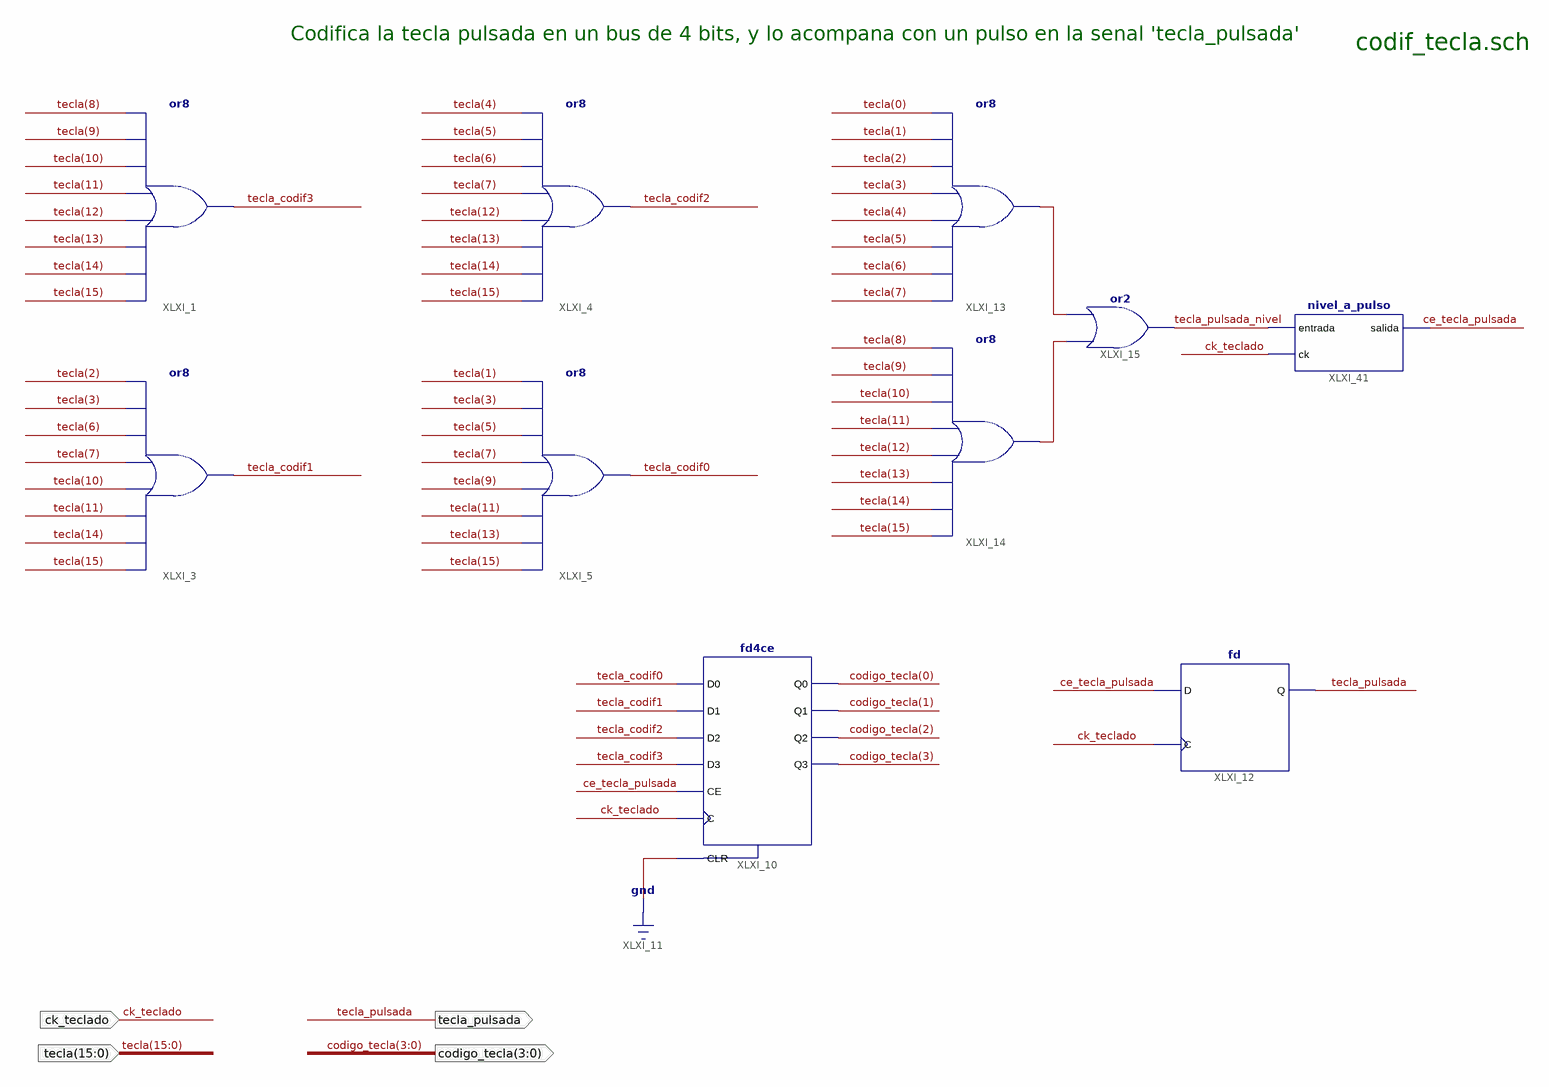
[diagram p0: schematic sheet 1]
// Xilinx ISE schematic codif_tecla.sch (spartan6) as structural Verilog: 10 symbols, 5 ports
module codif_tecla (
  input  [15:0] tecla,
  input  ck_teclado,
  output [3:0] codigo_tecla,
  output tecla_pulsada
);

  wire ce_tecla_pulsada, tecla_codif0, tecla_codif1, tecla_codif2, tecla_codif3, tecla_pulsada_nivel,
       XLXN_209, XLXN_210;

  fd XLXI_12 (.C(ck_teclado), .D(ce_tecla_pulsada), .Q(tecla_pulsada));
  fd4ce XLXI_10 (
    .C(ck_teclado), .CE(ce_tecla_pulsada), .CLR(1'b0), .D0(tecla_codif0), .D1(tecla_codif1),
    .D2(tecla_codif2), .D3(tecla_codif3), .Q0(codigo_tecla[0]), .Q1(codigo_tecla[1]), .Q2(codigo_tecla[2]),
    .Q3(codigo_tecla[3]));
  or XLXI_1 (tecla_codif3, tecla[15], tecla[14], tecla[13], tecla[12], tecla[11], tecla[10], tecla[9], tecla[8]);
  or XLXI_3 (tecla_codif1, tecla[15], tecla[14], tecla[11], tecla[10], tecla[7], tecla[6], tecla[3], tecla[2]);
  or XLXI_4 (tecla_codif2, tecla[15], tecla[14], tecla[13], tecla[12], tecla[7], tecla[6], tecla[5], tecla[4]);
  or XLXI_5 (tecla_codif0, tecla[15], tecla[13], tecla[11], tecla[9], tecla[7], tecla[5], tecla[3], tecla[1]);
  or XLXI_13 (XLXN_209, tecla[7], tecla[6], tecla[5], tecla[4], tecla[3], tecla[2], tecla[1], tecla[0]);
  or XLXI_14 (XLXN_210, tecla[15], tecla[14], tecla[13], tecla[12], tecla[11], tecla[10], tecla[9], tecla[8]);
  or XLXI_15 (tecla_pulsada_nivel, XLXN_210, XLXN_209);
  nivel_a_pulso XLXI_41 (.salida(ce_tecla_pulsada), .ck(ck_teclado), .entrada(tecla_pulsada_nivel));

  // Notes on the sheet:
  //   Codifica la tecla pulsada en un bus de 4 bits, y lo acompana con un pulso en la senal 'tecla_pulsada'
  //   codif_tecla.sch
endmodule
